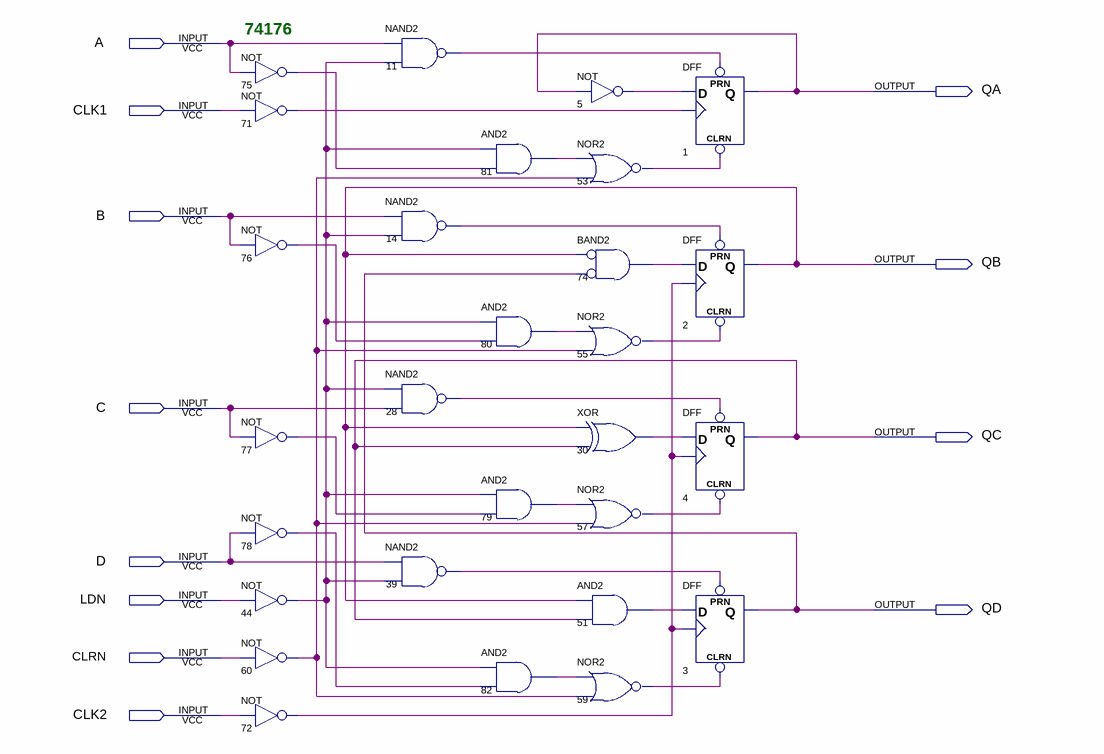
[diagram p0: schematic sheet]
// Quartus schematic 74176.bdf as structural Verilog: 28 symbols, 12 pins
module \74176  (
  input  A,
  input  CLK1,
  input  B,
  input  C,
  input  D,
  input  LDN,
  input  CLRN,
  input  CLK2,
  output QA,
  output QB,
  output QC,
  output QD
);

  wire n5_out, n11_out, n14_out, n28_out, n30_out, n39_out, n44_out, n51_out, n53_out, n55_out, n57_out,
       n59_out, n60_out, n71_out, n72_out, n74_out, n75_out, n76_out, n77_out, n78_out, n79_out, n80_out,
       n81_out, n82_out;

  not u_75 (n75_out, A);
  not u_71 (n71_out, CLK1);
  not u_76 (n76_out, B);
  not u_77 (n77_out, C);
  not u_78 (n78_out, D);
  not u_44 (n44_out, LDN);
  not u_60 (n60_out, CLRN);
  not u_72 (n72_out, CLK2);
  nand u_11 (n11_out, A, n44_out);
  nand u_14 (n14_out, B, n44_out);
  nand u_28 (n28_out, n44_out, C);
  nand u_39 (n39_out, D, n44_out);
  and u_81 (n81_out, n44_out, n75_out);
  and u_80 (n80_out, n44_out, n76_out);
  and u_79 (n79_out, n44_out, n77_out);
  and u_82 (n82_out, n44_out, n78_out);
  not u_5 (n5_out, QA);
  nor u_53 (n53_out, n81_out, n60_out);
  and u_74 (n74_out, ~QB, ~QD);  // BAND2
  nor u_55 (n55_out, n80_out, n60_out);
  xor u_30 (n30_out, QB, QC);
  nor u_57 (n57_out, n79_out, n60_out);
  and u_51 (n51_out, QB, QC);
  nor u_59 (n59_out, n82_out, n60_out);
  DFF u_1 (.CLRN(n53_out), .CLK(n71_out), .D(n5_out), .PRN(n11_out), .Q(QA));
  DFF u_2 (.CLRN(n55_out), .CLK(n72_out), .D(n74_out), .PRN(n14_out), .Q(QB));
  DFF u_4 (.CLRN(n57_out), .CLK(n72_out), .D(n30_out), .PRN(n28_out), .Q(QC));
  DFF u_3 (.CLRN(n59_out), .CLK(n72_out), .D(n51_out), .PRN(n39_out), .Q(QD));

  // Notes on the sheet:
  //   74176
endmodule
